# Altium schematic sheet TDA7439DS.SchDoc
size A4; SheetNumber: 3; SheetTotal: 8
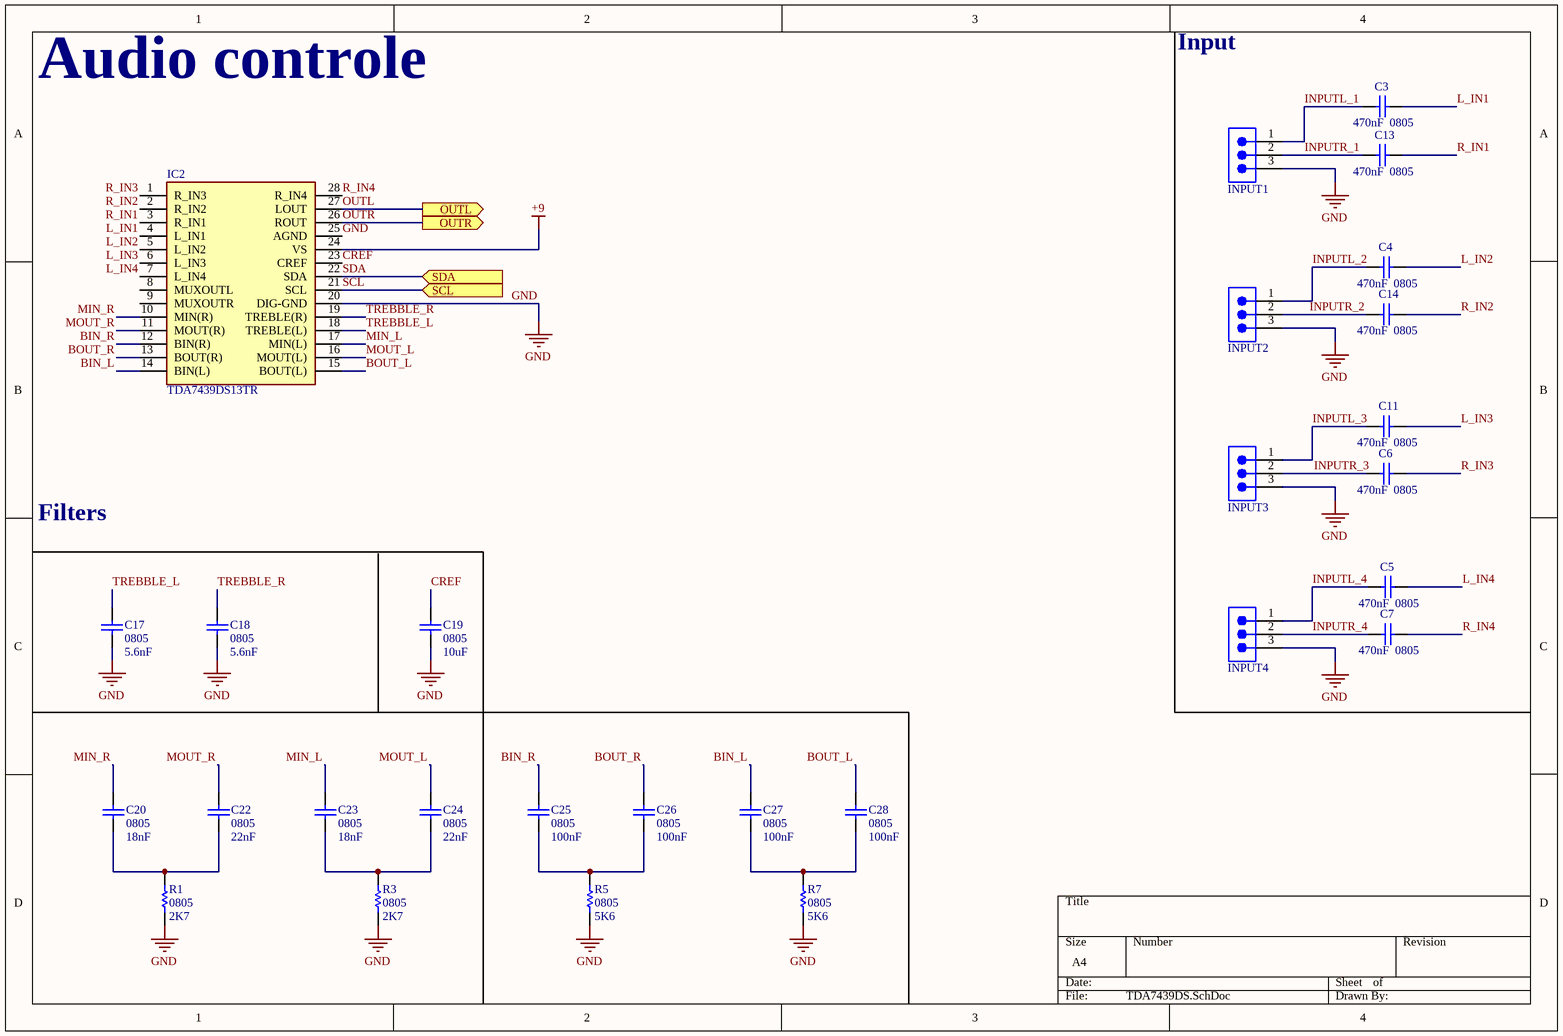
[diagram p0: TDA7439DS.SchDoc]

## Parts
C3  0805  value 470nF  [6-0805_N]
C4  0805  value 470nF  [6-0805_N]
C5  0805  value 470nF  [6-0805_N]
C6  0805  value 470nF  [6-0805_N]
C7  0805  value 470nF  [6-0805_N]
C11  0805  value 470nF  [6-0805_N]
C13  0805  value 470nF  [6-0805_N]
C14  0805  value 470nF  [6-0805_N]
C17  0805  value 5.6nF  [6-0805_N]
C18  0805  value 5.6nF  [6-0805_N]
C19  0805  value 10uF  [6-0805_N]
C20  0805  value 18nF  [6-0805_N]
C22  0805  value 22nF  [6-0805_N]
C23  0805  value 18nF  [6-0805_N]
C24  0805  value 22nF  [6-0805_N]
C25  0805  value 100nF  [6-0805_N]
C26  0805  value 100nF  [6-0805_N]
C27  0805  value 100nF  [6-0805_N]
C28  0805  value 100nF  [6-0805_N]
IC2  TDA7439DS13TR  [SOIC127P1032X265-28N]
INPUT1  TSW-103-07-F-S  [SMTC-TSW-103-07-X-S]  (value not drawn)
INPUT2  TSW-103-07-F-S  [SMTC-TSW-103-07-X-S]  (value not drawn)
INPUT3  TSW-103-07-F-S  [SMTC-TSW-103-07-X-S]  (value not drawn)
INPUT4  TSW-103-07-F-S  [SMTC-TSW-103-07-X-S]  (value not drawn)
R1  0805  value 2K7  [6-0805_N]
R3  0805  value 2K7  [6-0805_N]
R5  0805  value 5K6  [6-0805_N]
R7  0805  value 5K6  [6-0805_N]

## Ports
OUTL (out, see Main[1A]), OUTR (out, see Main[1A]), SCL (in, see Main[1B], ATtiny[1B]), SDA (in, see Main[1B], ATtiny[1B])

## Nets
+9: IC2.24(VS)
GND: C17.2 C18.2 C19.2 IC2.20(DIG-GND) IC2.25(AGND) INPUT1.3 INPUT2.3 INPUT3.3 INPUT4.3 R1.1 R3.1 R5.1 R7.1
BIN_L: C27.1 IC2.14(BIN(L))
BIN_R: C25.1 IC2.12(BIN(R))
BOUT_L: C28.1 IC2.15(BOUT(L))
BOUT_R: C26.1 IC2.13(BOUT(R))
CREF: C19.1 IC2.23(CREF)
INPUTL_1: C3.1 INPUT1.1
INPUTL_2: C4.1 INPUT2.1
INPUTL_3: C11.1 INPUT3.1
INPUTL_4: C5.1 INPUT4.1
INPUTR_1: C13.1 INPUT1.2
INPUTR_2: C14.1 INPUT2.2
INPUTR_3: C6.1 INPUT3.2
INPUTR_4: C7.1 INPUT4.2
L_IN1: C3.2 IC2.4(L_IN1)
L_IN2: C4.2 IC2.5(L_IN2)
L_IN3: C11.2 IC2.6(L_IN3)
L_IN4: C5.2 IC2.7(L_IN4)
MIN_L: C23.1 IC2.17(MIN(L))
MIN_R: C20.1 IC2.10(MIN(R))
MOUT_L: C24.1 IC2.16(MOUT(L))
MOUT_R: C22.1 IC2.11(MOUT(R))
OUTL: IC2.27(LOUT) ; port OUTL
OUTR: IC2.26(ROUT) ; port OUTR
R_IN1: C13.2 IC2.3(R_IN1)
R_IN2: C14.2 IC2.2(R_IN2)
R_IN3: C6.2 IC2.1(R_IN3)
R_IN4: C7.2 IC2.28(R_IN4)
SCL: IC2.21(SCL) ; port SCL
SDA: IC2.22(SDA) ; port SDA
TREBBLE_L: C17.1 IC2.18(TREBLE(L))
TREBBLE_R: C18.1 IC2.19(TREBLE(R))
NetC20_2: C20.2 C22.2 R1.2
NetC23_2: C23.2 C24.2 R3.2
NetC25_2: C25.2 C26.2 R5.2
NetC27_2: C27.2 C28.2 R7.2

Not connected (* = marked no-connect by the designer): IC2 8(MUXOUTL) 9(MUXOUTR)

## Notes on the sheet
- Audio controle
- Input
- Filters

## Library data of the parts
C3-C7 C11 C13 C14 C17-C20 C22-C28 = Cap: Capacitor; Published: 8-Jun-2000; LatestRevisionDate: 17-Jul-2002; LatestRevisionNote: Re-released for DXP Platform.; PackageReference: RAD-0.3; Publisher: Altium Limited; PackageDescription: Radial Cap, Thru-Hole; 2 Leads; 0.3 in Pin Spacing
IC2 = TDA7439DS13TR: Integrated Circuit; Manufacturer_Name: STMicroelectronics; Datasheet Link: https://componentsearchengine.com//TDA7439DS13TR.pdf; Height: 2.65mm; Mouser2 Part Number: 511-TDA7439DS13TR; Mouser2 Price/Stock: https://www.mouser.com/Search/Refine.aspx?Keyword=511-TDA7439DS13TR; Manufacturer_Part_Number: TDA7439DS13TR
INPUT1-INPUT4 = CMP-1024-00331-1: 0.025" SQ Post Header, Through-hole, Vertical, -55 to 125 degC, 2.54 mm Pitch, 3-Pin, Male, RoHS; Manufacturer: Samtec; Pitch: 2.54 mm; DatasheetVersion: F-214; ComponentLink1Description: Manufacturer URL; ComponentLink3URL: http://www.samtec.com/documents/webfiles/cpdf/TSW-XXX-XX-XXX-X-XX-XXX-MKT.pdf; Mounting Technology: Through-hole; PackageDescription: .025[0.64] SQ. Post Terminal Strip Assembly; Temperature Range: -55 to 125 degC; ComponentLink3Description: Package Specification; Orientation: Vertical; PartNumber: TSW-103-07-F-S; RoHS: True; PackageVersion: DM, 8/1988; ComponentLink2Description: Datasheet; ComponentLink1URL: http://www.samtec.com; ComponentLink2URL: http://www.samtec.com/documents/webfiles/pdf/TSW_TH.PDF; PackageReference: TSW-103-07-X-S
R1 R3 R5 R7 = Res1: Resistor; Published: 8-Jun-2000; LatestRevisionDate: 17-Jul-2002; LatestRevisionNote: Re-released for DXP Platform.; PackageReference: AXIAL-0.3; Publisher: Altium Limited; PackageDescription: Axial Device, Thru-Hole; 2 Leads; 0.3 in Pin Spacing